# EAGLE schematic bromsbank (EAGLE 9.3.0)
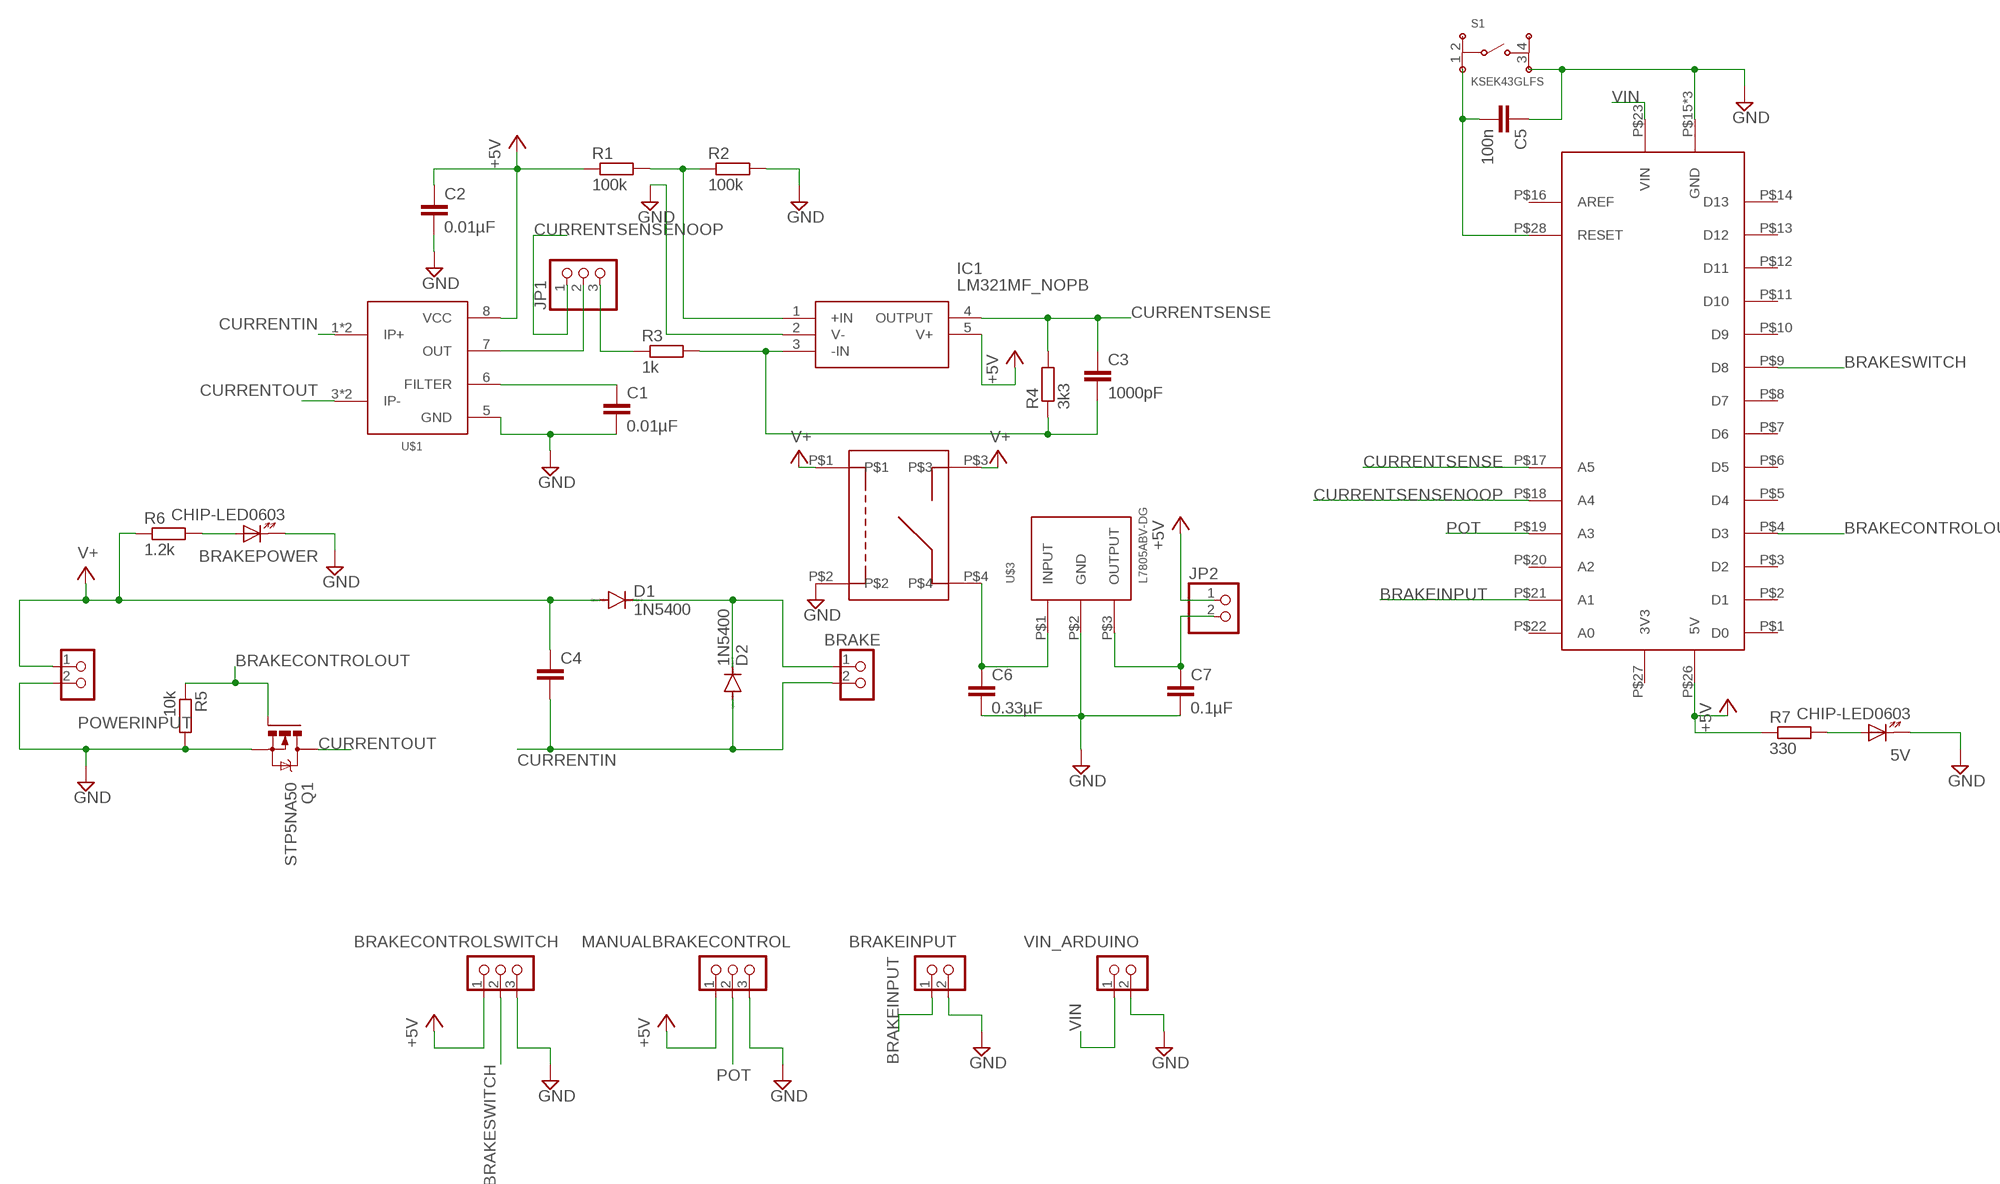
[diagram p0: schematic, sheet 1]

## Parts
5V  CHIP-LED0603  [CHIP-LED0603]
BRAKE  EH_B2B-EH  [B2B-EH]
BRAKECONTROLSWITCH  EH_B3B-EH  [B3B-EH]
BRAKEINPUT  EH_B2B-EH  [B2B-EH]
BRAKEPOWER  CHIP-LED0603  [CHIP-LED0603]
C1  0.01µF  C0603  [C0603]
C2  0.01µF  C0603  [C0603]
C3  1000pF  C0603  [C0603]
C4  C-EU075-063X106  [C075-063X106]
C5  100n  C0603  [C0603]
C6  0.33µF  C0603  [C0603]
C7  0.1µF  C0603  [C0603]
D1  1N5400  [DO201-15]
D2  1N5400  [DO201-15]
IC1  LM321MF_NOPB  [SOT95P280X145-5N]
JP1  PINHD-1X3  [1X03]
JP2  PINHD-1X2  [1X02]
MANUALBRAKECONTROL  EH_B3B-EH  [B3B-EH]
POWERINPUT  EH_B2B-EH  [B2B-EH]
Q1  STP5NA50  [TO220BV]
R1  100k  R0603  [R0603]
R2  100k  R0603  [R0603]
R3  1k  R0603  [R0603]
R4  3k3  R0603  [R0603]
R5  10k  R0603  [R0603]
R6  1.2k  R0603  [R0603]
R7  330  R0603  [R0603]
S1  KSEK43GLFS  [KSEK43GLFS]
U$1  ACS712ELCTR-05B-T  [SO08]
U$2  ARDUINO_SHIELD  [ARDUINO_UNO_SHIELD]
U$3  L7805ABV-DG  [TO-220]
U$4  RELAY_SDT-S-124DMR,601  [SDT-S-124DMR]
VIN_ARDUINO  EH_B2B-EH  [B2B-EH]

## Nets
+5V: BRAKECONTROLSWITCH.1 C2.1 IC1.5(V+) JP2.1 MANUALBRAKECONTROL.1 R1.1 R7.1 U$1.8(VCC) U$2.P$26(5V)
BRAKECONTROLOUT: Q1.G R5.1 U$2.P$4(D3)
BRAKEINPUT: BRAKEINPUT.1 U$2.P$21(A1)
BRAKESWITCH: BRAKECONTROLSWITCH.2 U$2.P$9(D8)
CURRENTIN [power]: BRAKE.2 C4.2 D2.A U$1.1(IP+) U$1.2(IP+)
CURRENTOUT [power]: Q1.D U$1.3(IP-) U$1.4(IP-)
CURRENTSENSE: C3.1 IC1.4(OUTPUT) R4.2 U$2.P$17(A5)
CURRENTSENSENOOP: JP1.1 U$2.P$18(A4)
FILTER: C1.1 U$1.6(FILTER)
GND [power]: 5V.C(K) BRAKECONTROLSWITCH.3 BRAKEINPUT.2 BRAKEPOWER.C(K) C1.2 C2.2 C5.1 C6.2 C7.2 IC1.2(V-) MANUALBRAKECONTROL.3 POWERINPUT.2 Q1.S R2.2 R5.2 S1.3 U$1.5(GND) U$2.P$15(GND) U$2.P$24(GND) U$2.P$25(GND) U$3.P$2(GND) U$4.P$2 VIN_ARDUINO.2
N$1: IC1.1(+IN) R1.2 R2.1
N$2: BRAKEPOWER.A R6.2
N$3 [power]: BRAKE.1 D1.C D2.C
N$4: JP1.2 U$1.7(OUT)
N$5: C5.2 S1.1 U$2.P$28(RESET)
N$6: JP1.3 R3.1
N$7: 5V.A R7.2
N$8: C3.2 IC1.3(-IN) R3.2 R4.1
N$9: C7.1 JP2.2 U$3.P$3(OUTPUT)
N$10 [power]: C6.1 U$3.P$1(INPUT) U$4.P$4
POT: MANUALBRAKECONTROL.2 U$2.P$19(A3)
V+ [power]: C4.1 D1.A POWERINPUT.1 R6.1 U$4.P$1 U$4.P$3
VIN [power]: U$2.P$23(VIN) VIN_ARDUINO.1
Unconnected: S1.2 S1.4 U$2.P$1(D0) U$2.P$2(D1) U$2.P$3(D2) U$2.P$5(D4) U$2.P$6(D5) U$2.P$7(D6) U$2.P$8(D7) U$2.P$10(D9) U$2.P$11(D10) U$2.P$12(D11) U$2.P$13(D12) U$2.P$14(D13) U$2.P$16(AREF) U$2.P$20(A2) U$2.P$22(A0)

## Power pins joined to a net without a drawn wire
3V3: U$2.P$27(3V3)

## Library data of the parts
5V BRAKEPOWER = CASE-LED:CHIP-LED0603: CHIP-LED0603 (SMD) Description: Standard 0603 SMD CHIP-LED
BRAKE BRAKEINPUT POWERINPUT VIN_ARDUINO = CASE-JST:EH_B2B-EH: JST EH Connector, through hole, 2 pin, top entry Description: JST EH connector with 2.5 mm pitch, through hole version, 2 pin, top entry. Links: Datasheet <http://www.jst-mfg.com/product/pdf/eng/eEH.pdf>
BRAKECONTROLSWITCH MANUALBRAKECONTROL = CASE-JST:EH_B3B-EH: JST EH Connector, through hole, 3 pin, top entry Description: JST EH connector with 2.5 mm pitch, through hole version, 3 pin, top entry. Links: Datasheet <http://www.jst-mfg.com/product/pdf/eng/eEH.pdf>
C1 C6 C7 = CASE-RCL:C0603: Standard Chip CAPACITOR 0605 (1608 Metric) Description: Standard Chip CAPACITOR 0605 (1608 Metric); SPICEPREFIX: C
C2 C3 C5 = CASE-RCL:C0603: Standard Chip CAPACITOR 0605 (1608 Metric) Description: Standard Chip CAPACITOR 0605 (1608 Metric)
C4 = rcl:C-EU: CAPACITOR, European symbol; SPICEPREFIX: C
D1 D2 = diode:1N5400: DIODE standard rectifier, 3 A, 50 V (Motorola)
IC1 = SamacSys_Parts:LM321MF_NOPB: Single SMT op amp,LM321MF 1MHz SOT23-5 Source: Datasheet; DESCRIPTION: Single SMT op amp,LM321MF 1MHz SOT23-5; HEIGHT: 1.45mm; MANUFACTURER_NAME: Texas Instruments; MANUFACTURER_PART_NUMBER: LM321MF/NOPB; MOUSER_PART_NUMBER: 926-LM321MF/NOPB
JP1 = CASE-Pinhead:PINHD-1X3: PIN HEADER
JP2 = CASE-Pinhead:PINHD-1X2: PIN HEADER
Q1 = transistor-power:STP5NA50: N-CHANNEL MOS FET
R1-R7 = CASE-RCL:R0603: Standard Chip RESISTOR 0603 (1608 Metric) Description: Standard Chip RESISTOR 0603 (1608 Metric)
S1 = CASE-Switches:KSEK43GLFS: C&K KSEK43G LFS Tactile SPST switch (SMD) Description: C&K KSEK43G LFS Tactile SPST switch SMD package. Links: KSEK43G LFS <http://www.farnell.com/datasheets/2706286.pdf?_ga=2.5848880.2071720333.1546461288-1112771566.1525371275>
U$1 = CVT:ACS712ELCTR-05B-T
U$2 = CVT:ARDUINO_SHIELD
U$3 = CVT:L7805ABV-DG
U$4 = CVT:RELAY_SDT-S-124DMR,601

## Net classes
0 default: width 0.254 mm
1 power: width 1.016 mm, clearance 0.254 mm